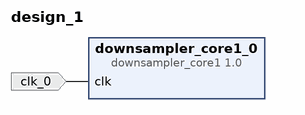
[diagram p0: block diagram of the top level]
# Vivado block design design_1, xcvu065-ffvc1517-1-i, Vivado 2024.1
create_bd_design design_1

create_bd_port -dir I -type clk clk_0

create_bd_cell -type ip -vlnv user.org:user:downsampler_core1:1.0 downsampler_core1_0

# ---- connections ----

connect_bd_net -net clk_0_1 [get_bd_ports clk_0] [get_bd_pins downsampler_core1_0/clk]

validate_bd_design
save_bd_design
